# Altium schematic sheet CLK_Protection.SchDoc: SVPXFMC Carrier 3U
size A4; CheckedBy: \; Author: G.Kasprowicz; CompanyName: ISE; DrawnBy: T.Przywozki; Organization: WUT ISE; Address1: Warsaw University of Technology; Address2: Nowowiejska 15/19 00-665 Warsaw; Revision: 1.0.; SheetNumber: 20; SheetTotal: 20; Project: SVPXFMC Carrier 3U; ModifiedBy: -; CheckedDate: -; Title2: Clock protection; DivGrp: ISE; Designer: G. Kasprowicz
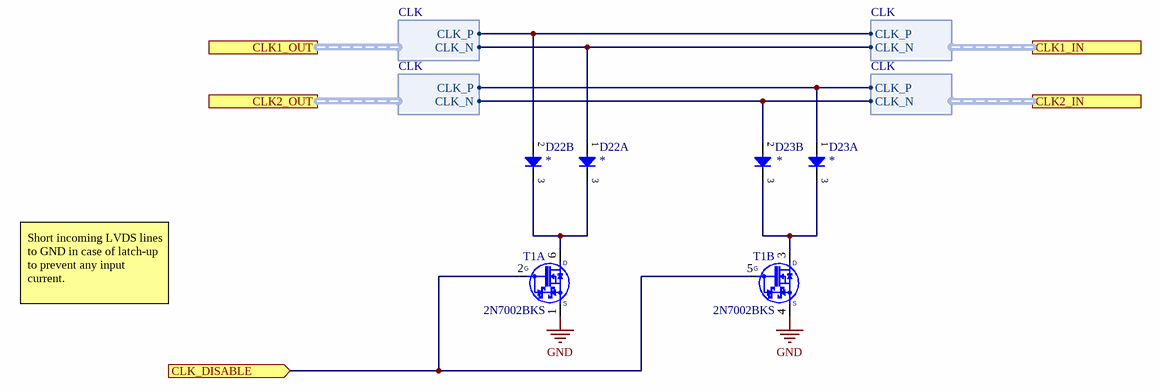
[diagram p0: CLK_Protection.SchDoc]

## Parts
D22  *  [SOT65P210X110-3N]  (parts A,B of 2)
D23  *  [SOT65P210X110-3N]  (parts A,B of 2)
T1  2N7002BKS  [SOT65P210X110-6N]  (parts A,B of 2)

## Ports
CLK1_IN (harness CLK), CLK1_OUT (harness CLK), CLK2_IN (harness CLK), CLK2_OUT (harness CLK), CLK_DISABLE (in)

## Harnesses
CLK: CLK_P, CLK_N

## Nets
GND: T1.1(S) T1.4(S)
CLK_DISABLE: T1.2(G) T1.5(G) ; port CLK_DISABLE
NetD22_1: D22.1(A) ; port CLK1_IN.CLK_N, port CLK1_OUT.CLK_N
NetD22_2: D22.2(A) ; port CLK1_IN.CLK_P, port CLK1_OUT.CLK_P
NetD22_3: D22.3(COMC) T1.6(D)
NetD23_1: D23.1(A) ; port CLK2_IN.CLK_P, port CLK2_OUT.CLK_P
NetD23_2: D23.2(A) ; port CLK2_IN.CLK_N, port CLK2_OUT.CLK_N
NetD23_3: D23.3(COMC) T1.3(D)

## Notes on the sheet
- Short incoming LVDS lines to GND in case of latch-up to prevent any input current.
- Project/Equipment
- Document
- Designer
- Drawn by
- Check.by
- Copyright WUT ISE 2019
  This documentation describes Open Hardware and is licensed under the CERN OHL v.1.1. You may redistribute and modify this documentation under the terms of the CERN OHL v1.1.
  (http://ohwr.org/CERNOHL). This documentation is dristributed WITHOUT ANY EXPRESS OR IMPLIED WARRANTY, INCLUDING OF MERCHANTABILITY, SATISFACTORY QUALITY AND FITNESS FOR A PARTICULAR PURPOSE. Please see the CERN OHL v.1.1 for applicable conditions
- File
- Last Mod.
- Print Date
- Sheet
- Size
- A4
- of
- Rev

## Library data of the parts
D22 D23 = BAT1705WH: Manufacturer Part Number: BAT1705WH6327; Bonding: No; PressFit: No; Case: *; Component Kind: Standard; Component Type: Standard; ComponentHeigth: *; CreateDate: 2018-01-01; Device: *; Footprint: *; HelpURL: *; LatestRevisionDate: 2018-01-01; Manufacturer: *; Mounted: Yes; PackageDescription: *; Part Description: *; Part Number: BAT1705WH6327; Pin Count: *; Sense: No; SMD: Yes; Socket: No; Value: *
T1 = 2N7002BKS: 60V, 300mA Dual N-Channel Trench MOSFET; Manufacturer: NXP SEMICONDUCTORS; Manufacturer Part Number: 2N7002BKS6; PressFit: No; Bonding: No; Part Number: 2N7002BKS; Component Kind: Standard; Component Type: Standard; Device: 2N7002BKS; PackageDescription: SOT363, SC70-6, SOT, 0.65mm Pitch, 6 pin, 1.25mm W X 2.00mm L X 1.10mm H, IPC Medium Density; Part Description: 60 V, 300 mA Dual N-Channel Trench MOSFET; Pin Count: 4; Case: SOT363; Mounted: Yes; Socket: No; SMD: Yes; Sense: No; ComponentHeight: 1.1mm; HelpURL: \\cern.ch\dfs\Applications\Altium\Datasheets\2N7002BKS.pdf; Author: CERN DEM JLC; CreateDate: 2012-11-27; LatestRevisionDate: 2012-11-27